# Altium project Borne_de_Recharge_électrique.PrjPcb
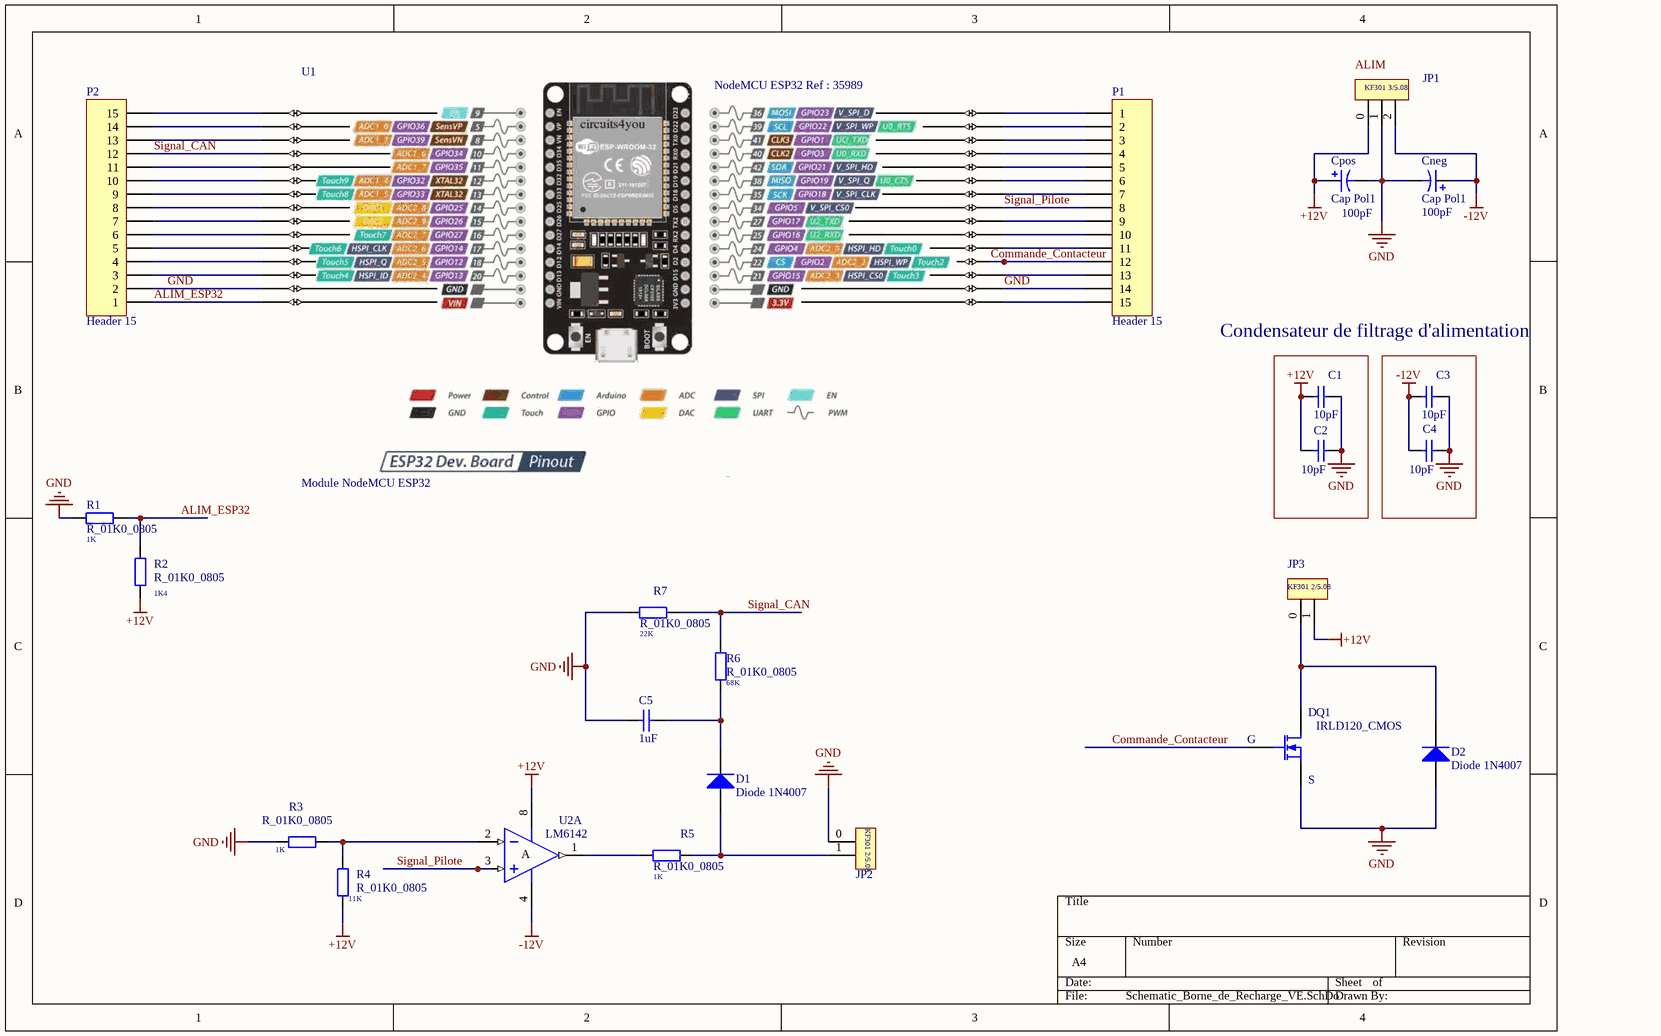
[diagram p0: Schematic_Borne_de_Recharge_VE.SchDoc]
1 sheet, 24 parts. Net scope: global (net labels, ports and power ports of the same name join across sheets).
Board file: PCB_Borne_de_Recharge_VE.PcbDoc

## Sheet Schematic_Borne_de_Recharge_VE.SchDoc
size A4; SheetNumber: 1; SheetTotal: 1; SPICEModelCacheUKYPAQKU: <root> / <DocumentId>UKYPAQKU</DocumentId> / <CacheFrame Number="0"> / <Model Name="1n4007" Kind="MDL"> / <Text>*1N4007 MCE 8-16-95 / *1000V 1A Si GenPurpose Diode pkg:DIODE0.4 1,2 / .MODEL 1N4007 D(IS=2.55E-9 RS=0.042 N=1.75 TT=5.76E-6 CJO=1.85E-11 / + VJ=0.75 M=0.333 BV=1000 IBV=9.86E-5 )</Text> / </Model> / </CacheFrame> / </root>

### Parts
C1  value 10pF  [AXIAL-0.3]  (hidden comment: Capacitor tantal)
C2  value 10pF  [AXIAL-0.3]  (hidden comment: Capacitor tantal)
C3  value 10pF  [AXIAL-0.3]  (hidden comment: Capacitor tantal)
C4  value 10pF  [AXIAL-0.3]  (hidden comment: Capacitor tantal)
C5  value 1uF  [AXIAL-0.3]  (hidden comment: Capacitor tantal)
Cneg  Cap Pol1  value 100pF  [RB7.6-15]
Cpos  Cap Pol1  value 100pF  [RB7.6-15]
D1  Diode 1N4007  [DO-41]
D2  Diode 1N4007  [DO-41]
JP1  Screw Terminal 3/5.08  [KF301_3/5.08]  (value not drawn)
JP2  Screw Terminal 2/5.08  [KF301_2/5.08]  (value not drawn)
JP3  Screw Terminal 2/5.08  [KF301_2/5.08]  (value not drawn)
P1  Header 15  [HDR1X15]
P2  Header 15  [HDR1X15]
Q1  IRLD120_CMOS  [TO-250]
R1  R_01K0_0805  value 1K  [RESC2012X05N]
R2  R_01K0_0805  value 1K4  [RESC2012X05N]
R3  R_01K0_0805  value 1K  [RESC2012X05N]
R4  R_01K0_0805  value 11K  [RESC2012X05N]
R5  R_01K0_0805  value 1K  [RESC2012X05N]
R6  R_01K0_0805  value 68K  [RESC2012X05N]
R7  R_01K0_0805  value 22K  [RESC2012X05N]
U1  Module NodeMCU ESP32  [NodeMCU ESP32]
U2  LM6142  [DIL 8]  (part A of 2)

### Nets
+12V: C1.1 C2.1 Cpos.1 JP1.0 JP3.1 R2.1 R4.1 U2.8(V+)
-12V: C3.1 C4.1 Cneg.1 JP1.2 U2.4(V-)
GND: C1.2 C2.2 C3.2 C4.2 C5.2 Cneg.2 Cpos.2 D2.1(A) JP1.1 JP2.0 P1.14 P2.2 Q1.2(S) R1.2 R3.1 R7.1 U1.14(GND) U1.17(GND)
ALIM_ESP32: P2.1 R1.1 R2.2 U1.15(Vin)
Commande_Contacteur: P1.12 Q1.3(G) U1.19(D2)
Signal_CAN: P2.12 R6.2 R7.2 U1.4(D34)
Signal_Pilote: P1.8 U1.23(D5) U2.3(IN+)
NetC5_1: C5.1 D1.2(K) R6.1
NetD1_1: D1.1(A) JP2.1 R5.2
NetD2_2: D2.2(K) JP3.0 Q1.1(D)
NetP1_1: P1.1 U1.30(D23)
NetP1_2: P1.2 U1.29(D22)
NetP1_3: P1.3 U1.28(TX0)
NetP1_4: P1.4 U1.27(RX0)
NetP1_5: P1.5 U1.26(D21)
NetP1_6: P1.6 U1.25(D19)
NetP1_7: P1.7 U1.24(D18)
NetP1_9: P1.9 U1.22(TX2)
NetP1_10: P1.10 U1.21(RX2)
NetP1_11: P1.11 U1.20(D4)
NetP1_13: P1.13 U1.18(D15)
NetP1_15: P1.15 U1.16(3V3)
NetP2_3: P2.3 U1.13(D13)
NetP2_4: P2.4 U1.12(D12)
NetP2_5: P2.5 U1.11(D14)
NetP2_6: P2.6 U1.10(D27)
NetP2_7: P2.7 U1.9(D26)
NetP2_8: P2.8 U1.8(D25)
NetP2_9: P2.9 U1.7(D33)
NetP2_10: P2.10 U1.6(D32)
NetP2_11: P2.11 U1.5(D35)
NetP2_13: P2.13 U1.3(VN)
NetP2_14: P2.14 U1.2(VP)
NetP2_15: P2.15 U1.1(EN)
NetR3_2: R3.2 R4.2 U2.2(IN-)
NetR5_1: R5.1 U2.1(OUT)

### Notes on the sheet
- Condensateur de filtrage d'alimentation
- Labels drawn without touching a wire or pin: ALIM
- (in symbol LM6142, part A) A
- (in symbol NodeMCU ESP 32) NodeMCU ESP32 Ref : 35989
- (in symbol Screw Terminal 2/5.08) KF301 2/5.08
- (in symbol Screw Terminal 3/5.08) KF301 3/5.08

### Library data of the parts
C1-C5 = Capacitor tantal: Capacitor; Published: 8-Jun-2000; LatestRevisionDate: 29-May-2009; LatestRevisionNote: IPC-7351 Footprint Added.; PackageReference: C0805; Publisher: Altium Limited; PackageDescription: Chip Capacitor
Cneg Cpos = Cap Pol1: Polarized Capacitor (Radial); Published: 8-Jun-2000; LatestRevisionDate: 17-Jul-2002; LatestRevisionNote: Re-released for DXP Platform.; PackageReference: RB7.6-15; Publisher: Altium Limited; PackageDescription: Polarized Capacitor (Radial); 2 Leads
D1 D2 = Diode 1N4007: 1 Amp General Purpose Rectifier; Published: 8-Jun-2000; LatestRevisionDate: 17-Jul-2002; LatestRevisionNote: Re-released for DXP Platform.; DatasheetVersion: 1998; PackageVersion: Aug-1999; PackageReference: DO-41; Publisher: Altium Limited; PackageDescription: Diode, Axial; Body 5.2 x 2.7 mm (LxDia. max), Lead Dia. 0.86 mm (max); Code_JEDEC: DO-204-AL; ComponentLink1Description: Manufacturer Link; ComponentLink1URL: http://www.fairchildsemi.com/; ComponentLink2Description: Datasheet; ComponentLink2URL: http://www.fairchildsemi.com/ds/1N%2F1N4001.pdf
JP1 = Screw Terminal 3/5.08: KF301 3 contacts / 5.08 mm; Supplier 1: Farnell; Supplier Part Number 1: 3041530
JP2 JP3 = Screw Terminal 2/5.08: KF301 2 contacts / 5.08mm; Supplier 1: Farnell; Supplier Part Number 1: 3041529
P1 P2 = Header 15: Header, 15-Pin; LatestRevisionDate: 17-Jul-2002; LatestRevisionNote: Re-released for DXP Platform.; Publisher: Altium Limited
Q1 = IRLD120: N-Channel MOSFET; Published: 8-Jun-2000; LatestRevisionDate: 17-Jul-2002; LatestRevisionNote: Re-released for DXP Platform.; PackageVersion: 1995/1996; PackageReference: E3; Publisher: Altium Limited; PackageDescription: TO, Flat Index; 3 In-Line, Axial Leads; Body Dia. 4.6mm; Lead Dia. 0.5 mm (max); Supplier 1: Farnell; Supplier Part Number 1: 9102531
R1-R7 = R_01K0_0805: Resistor 1K Ohms 1/4W 0805 1%; Mounting: YES
U1 = NodeMCU ESP 32
U2 = LM6142: 17 MHz Rail-to-Rail Input-Output Operational Amplifier; Published: 16-Jan-2001; LatestRevisionDate: 04-Mar-2005; LatestRevisionNote: Stylized 3D Model Added.; DatasheetVersion: Feb-1999; PackageVersion: Jun-1999; PackageReference: P008; Publisher: Altium Limited; PackageDescription: DIP; 8 Leads; Row Spacing 7.62 mm; Pitch 2.54 mm; Code_JEDEC: MO-001-AN; ComponentLink1Description: Manufacturer Link; ComponentLink1URL: http://www.ti.com/; ComponentLink2Description: Datasheet; ComponentLink2URL: http://www-s.ti.com/sc/ds/tl082.pdf; Supplier 1: Mouser; Supplier Part Number 1: 926-LM6142BIM